# EAGLE design motor (EAGLE 7.5.0)
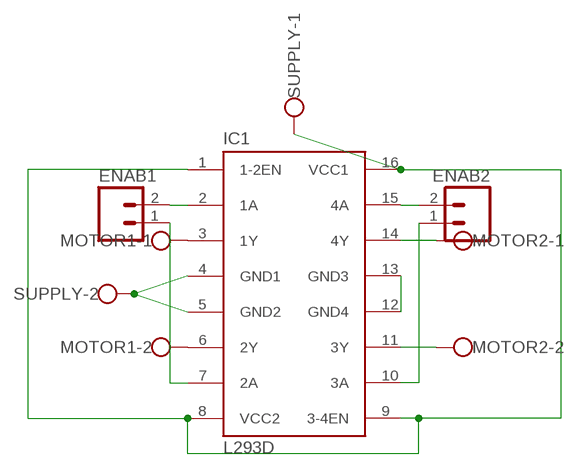
[diagram p0: schematic, sheet 1]

## Parts
ENAB1  M02PTH3  [1X02_LONGPADS]
ENAB2  M02PTH3  [1X02_LONGPADS]
IC1  L293D  [DIL16]
MOTOR1  W237-102  [W237-102]
MOTOR2  W237-102  [W237-102]
SUPPLY  W237-102  [W237-102]

## Nets
GND: IC1.4(GND1) IC1.5(GND2) SUPPLY.2
MOTOR2: IC1.11(3Y) MOTOR2.2
N$2: ENAB2.2 IC1.15(4A)
N$3: IC1.1(1-2EN) IC1.8(VCC2) IC1.9(3-4EN) IC1.16(VCC1) SUPPLY.1
N$20: IC1.3(1Y) MOTOR1.1
N$21: IC1.6(2Y) MOTOR1.2
N$22: IC1.12(GND4) IC1.13(GND3)
N$23: ENAB1.2 IC1.2(1A)
N$25: ENAB2.1 IC1.10(3A)
N$26: ENAB1.1 IC1.7(2A)
N$27: IC1.14(4Y) MOTOR2.1

## Library data of the parts
ENAB1 ENAB2 = SparkFun-Connectors:M02: Header 2 Standard 2-pin 0.1" header. Use with straight break away headers (SKU : PRT-00116), right angle break away headers (PRT-00553), swiss pins (PRT-00743), machine pins (PRT-00117), and female headers (PRT-00115). Molex polarized connector foot print use with SKU : PRT-08233 with associated crimp pins and housings.
IC1 = st-microelectronics:L293D: PUSH-PULL 4 CHANNEL DRIVER; MPN: L293D; OC_FARNELL: 9589619; OC_NEWARK: 56P8249
MOTOR1 MOTOR2 SUPPLY = con-wago-500:W237-102: WAGO SCREW CLAMP; MPN: 237-102; OC_FARNELL: unknown; OC_NEWARK: 70K9898

## Board
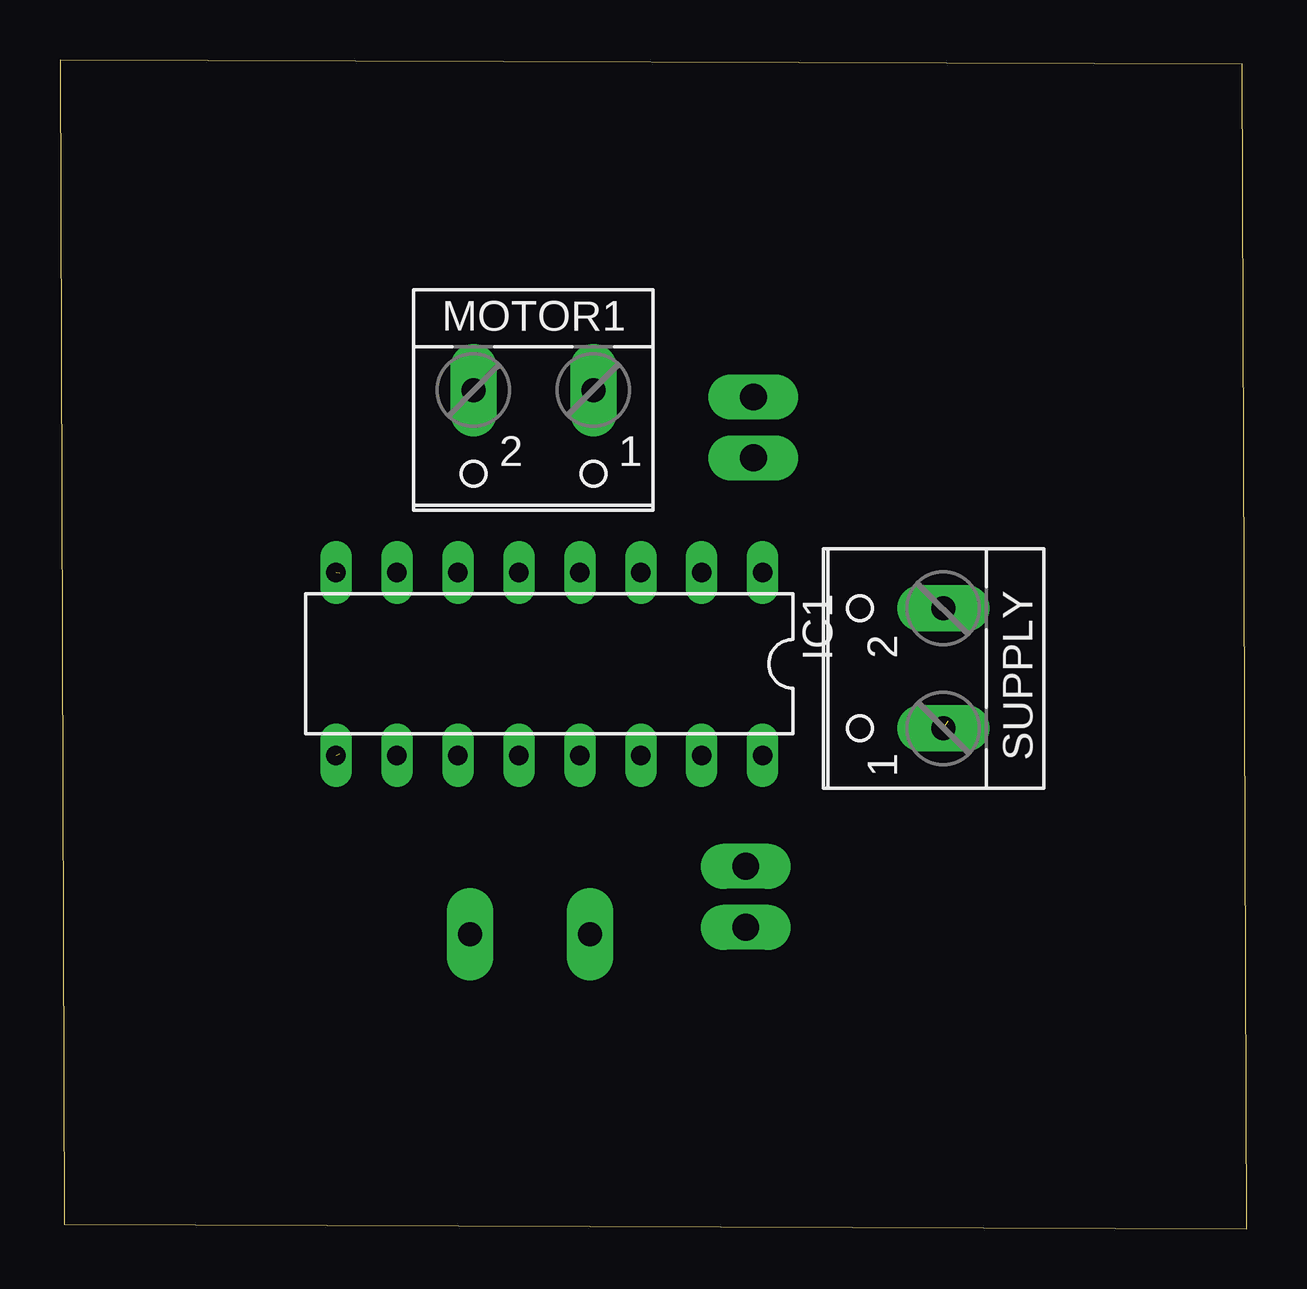
[diagram p1: board, top side]
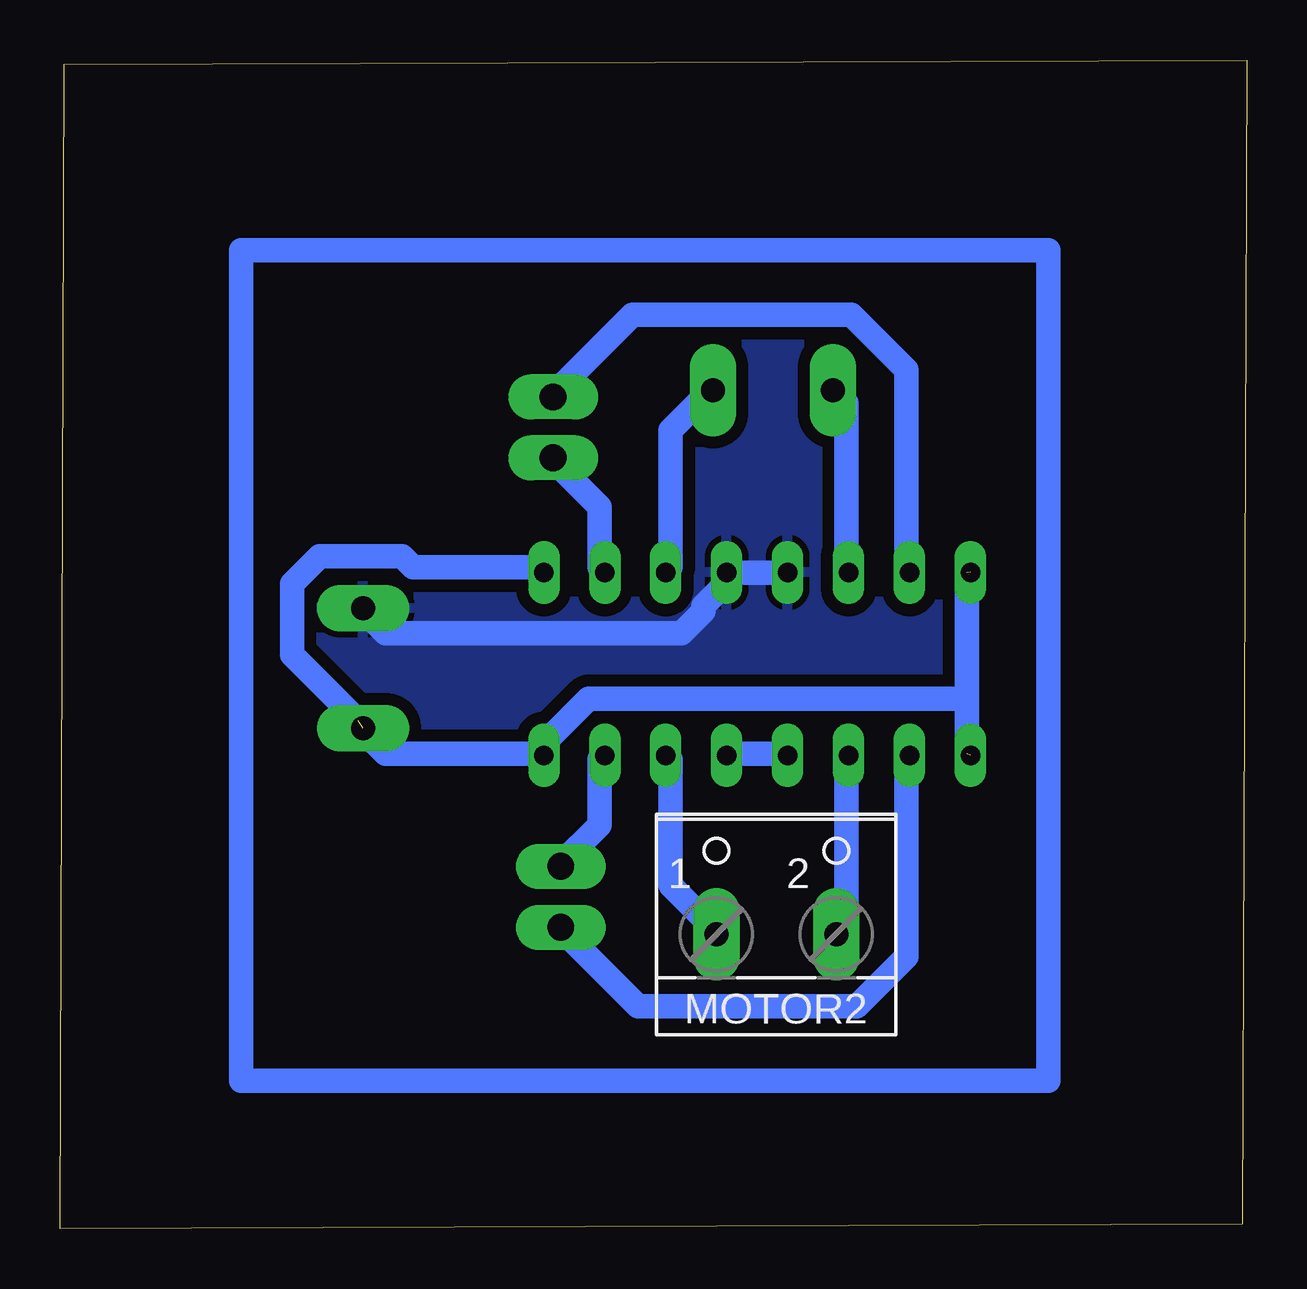
[diagram p2: board, bottom side, seen from below]

Size 49.46 x 48.69 mm. Coordinates in mm from the lower left corner, seen from the top.
Outline: 0.17,0.17 49.46,0 49.29,48.52 0,48.69 0.17,0.17
Copper layers (1*16): Top 0.035mm / dielectric 1.5mm / Bottom 0.035mm
Design rules "default *": minimum track width 40mil, minimum drill 24mil, track to track 20mil, track to pad 20mil, pad to pad 8mil, via to via 8mil, smd to smd 8mil, copper to edge 40mil, drill to drill 8mil, minimum pad ring 10mil, minimum via ring 8mil, stop-mask expansion 4mil, vias tented up to drill 0mil, thermal gap 10mil

### Footprints (pad centres in the part's own frame; a part is rotated, then mirrored left to right if it is on the bottom)
1X02_LONGPADS = drill 1.118 pad 1.88 long: 1 0,0; 2 2.54,0
DIL16 = drill 0.813 long: 1 -8.89,-3.81; 2 -6.35,-3.81; 3 -3.81,-3.81; 4 -1.27,-3.81; 5 1.27,-3.81; 6 3.81,-3.81; 7 6.35,-3.81; 8 8.89,-3.81; 9 8.89,3.81; 10 6.35,3.81; 11 3.81,3.81; 12 1.27,3.81; 13 -1.27,3.81; 14 -3.81,3.81; 15 -6.35,3.81; 16 -8.89,3.81
W237-102 = drill 1 pad 1.93 long: 1 -2.5,-1.27; 2 2.5,-1.27

### Placement (x,y rotation side)
ENAB1  28.9,34.65 270 top
ENAB2  28.58,12.56 90 top
IC1  20.4,23.53 180 top
MOTOR1  19.74,33.66 180 top
MOTOR2  19.6,13.53 0 bottom
SUPPLY  35.55,23.34 90 top

### Tracks (layer width: path | path; a pad name or v marks a point on that pad's centre or on a via)
GND
  Bottom 1.016: IC1.5 19.2,27.33 21.49,27.33 IC1.4 21.72,26.87 22.63,25.96 22.63,25.73 23.55,24.82 35.89,24.82 36.8,25.73 SUPPLY.2
  pour Bottom: 9.84,40.45 42.23,40.45 42.23,6.16 8.57,6.16 8.57,40.45 9.21,40.45
MOTOR2
  Bottom 1.016: IC1.11 16.69,19.56 16.69,12.7 16.92,12.47 MOTOR2.2
N$1
  Bottom 1.016: 8.26,19.18 8.26,40.77 41.91,40.77 41.91,6.16 8.26,6.16 8.26,18.86 8.26,19.18
N$2
  Bottom 1.016: IC1.15 26.98,19.56 26.98,16.81 28.57,15.21 ENAB2.2
N$3  (3 unrouted)
  Bottom 1.016: 11.66,27.33 11.66,22.07 | 11.66,22.07 11.66,19.79 | SUPPLY.1 36.8,20.7 35.89,19.79 29.49,19.79 IC1.16 29.26,20.24 27.43,22.07 11.66,22.07 | 37.03,21.16 39.78,23.9 39.78,26.87 38.63,28.02 35.2,28.02 34.75,27.56 29.49,27.56 IC1.1
N$20
  Bottom 1.016: IC1.3 24,27.56 24,33.27 22.4,34.87 MOTOR1.1
N$21
  Bottom 1.016: IC1.6 16.69,27.56 16.69,34.42 17.14,34.87 MOTOR1.2
N$22
  Bottom 1.016: IC1.12 19.2,19.79 21.49,19.79 IC1.13
N$23
  Bottom 1.016: IC1.2 26.98,27.56 26.98,30.07 28.8,31.9 ENAB1.2
N$25
  Bottom 1.016: IC1.10 14.17,19.56 14.17,11.33 16.23,9.27 25.38,9.27 28.57,12.47 ENAB2.1
N$26
  Bottom 1.016: IC1.7 14.17,27.56 14.17,35.79 16.46,38.07 25.6,38.07 28.8,34.87 ENAB1.1
N$27
  Bottom 1.016: IC1.14 24,19.56 24,14.3 22.17,12.47 MOTOR2.1